# Altium schematic sheet W25Q32.SchDoc
size A; SheetNumber: 10; SheetTotal: 12
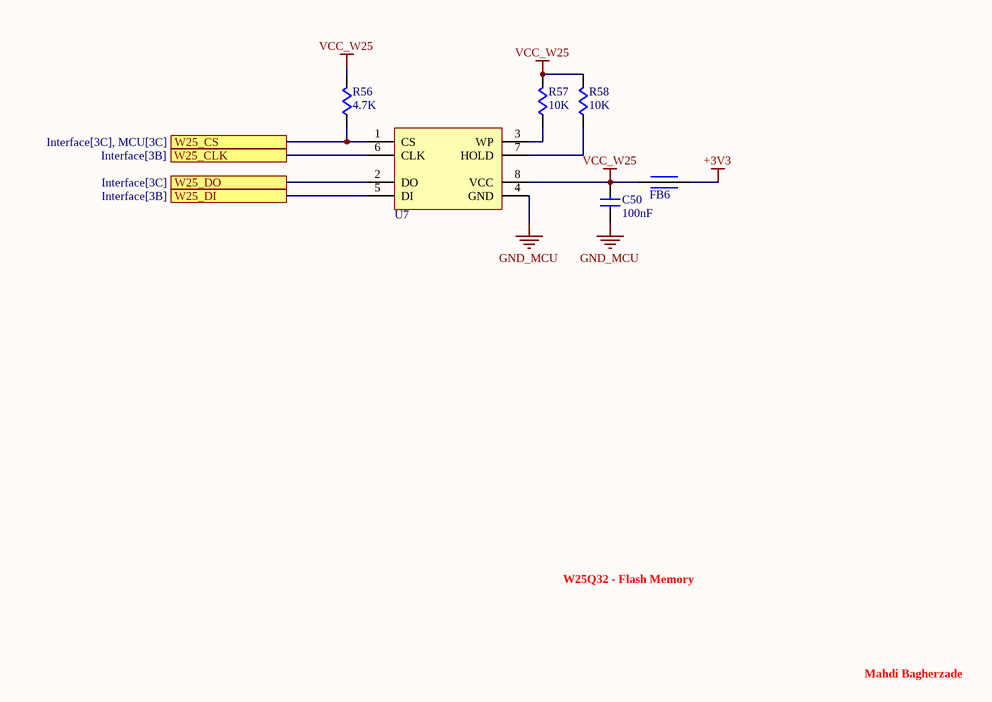
[diagram p0: W25Q32.SchDoc]

## Parts
C50  value 100nF  [C-0805]  (hidden comment: CAP Cer 100nF-50V-X7R-SMD)
FB6  Ferrite Bead SMD  [FB-0805]  (value not drawn)
R56  value 4.7K  [R-0805]  (hidden comment: RES 4.7K-5%-1/8W-SMD)
R57  value 10K  [R-0805]  (hidden comment: RES 10K-5%-1/8W-SMD)
R58  value 10K  [R-0805]  (hidden comment: RES 10K-5%-1/8W-SMD)
U7  IC W25Qxx-SMD  [SOIC8-W]  (value not drawn)

## Ports
W25_CLK (see Interface[3B]), W25_CS (see Interface[3C], MCU[3C]), W25_DI (see Interface[3B]), W25_DO (see Interface[3C])

## Nets
+3V3: FB6.1
GND_MCU: C50.1 U7.4(GND)
VCC_W25: C50.2 FB6.2 R56.2 R57.2 R58.2 U7.8(VCC)
W25_CLK: U7.6(CLK) ; port W25_CLK
W25_CS: R56.1 U7.1(CS) ; port W25_CS
W25_DI: U7.5(DI) ; port W25_DI
W25_DO: U7.2(DO) ; port W25_DO
NetR57_1: R57.1 U7.3(WP)
NetR58_1: R58.1 U7.7(HOLD)

## Notes on the sheet
- W25Q32 - Flash Memory
- Mahdi Bagherzade

## Library data of the parts
C50 = CAP-CER: CAPACITOR; Phone Number: 0915 8700 314; Voltage: 50V; Tolerance: X7R; Type: SMD; Publisher: Mahdi Bagherzadeh; ComponentLink1Description: Linkedin; ComponentLink1URL: https://ir.linkedin.com/in/mahdi-bagherzade; Published Date: 9-15-2024
FB6 = FERRITE BEAD: INDUCATOR; Phone Number: 0915 8700 314; Publisher: Mahdi Bagherzadeh; ComponentLink1Description: Linkedin; ComponentLink1URL: https://ir.linkedin.com/in/mahdi-bagherzade; Published Date: 9-15-2024; Type: SMD
R56-R58 = RES: RESISTOR; Phone Number: 0915 8700 314; Power: 1/8W; Tolerance: 5%; Publisher: Mahdi Bagherzadeh; ComponentLink1Description: Linkedin; ComponentLink1URL: https://ir.linkedin.com/in/mahdi-bagherzade; Published Date: 9-15-2024; Type: SMD
U7 = W25Qxx: IC; Phone Number: 0915 8700 314; Publisher: Mahdi Bagherzadeh; ComponentLink1Description: Linkedin; ComponentLink1URL: https://ir.linkedin.com/in/mahdi-bagherzade; Published Date: 9-15-2024; Code: W25Qxx; Type: SMD